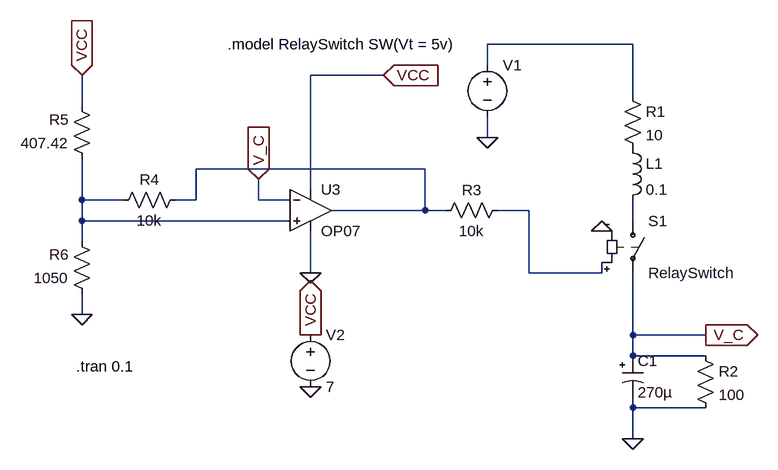
[diagram p0: schematic ON_OFF.asc]
ON_OFF.asc, the LTspice schematic file:
Version 4
SHEET 1 1508 680
WIRE 624 -112 400 -112
WIRE 400 -80 400 -112
WIRE 240 -64 128 -64
WIRE 624 -32 624 -112
WIRE -224 -16 -224 -64
WIRE 400 32 400 0
WIRE 304 80 -48 80
WIRE 128 112 128 -64
WIRE -224 128 -224 64
WIRE -160 128 -224 128
WIRE -48 128 -48 80
WIRE -48 128 -80 128
WIRE 48 128 48 96
WIRE 96 128 48 128
WIRE 304 144 304 80
WIRE 304 144 160 144
WIRE 336 144 304 144
WIRE 464 144 416 144
WIRE -224 160 -224 128
WIRE 96 160 -224 160
WIRE 624 160 624 128
WIRE -224 192 -224 160
WIRE 128 240 128 176
WIRE 464 240 464 144
WIRE 576 240 576 224
WIRE 576 240 464 240
WIRE -224 304 -224 272
WIRE 624 336 624 240
WIRE 736 336 624 336
WIRE 624 368 624 336
WIRE 736 368 624 368
WIRE 624 448 624 432
WIRE 736 448 624 448
WIRE 624 496 624 448
FLAG 48 96 V_C
IOPIN 48 96 In
FLAG -224 -64 VCC
IOPIN -224 -64 In
FLAG -224 304 0
FLAG 128 240 0
FLAG 240 -64 VCC
IOPIN 240 -64 In
FLAG 128 416 0
FLAG 128 336 VCC
IOPIN 128 336 Out
FLAG 624 496 0
FLAG 736 336 V_C
IOPIN 736 336 Out
FLAG 400 32 0
FLAG 576 176 0
SYMBOL res -64 112 R90
WINDOW 0 0 56 VBottom 2
WINDOW 3 32 56 VTop 2
SYMATTR InstName R4
SYMATTR Value 10k
SYMBOL res -208 80 R180
WINDOW 0 36 76 Left 2
WINDOW 3 36 40 Left 2
SYMATTR InstName R5
SYMATTR Value 407.42
SYMBOL res -208 288 R180
WINDOW 0 36 76 Left 2
WINDOW 3 36 40 Left 2
SYMATTR InstName R6
SYMATTR Value 1050
SYMBOL voltage 128 320 R0
WINDOW 123 0 0 Left 0
WINDOW 39 0 0 Left 0
SYMATTR InstName V2
SYMATTR Value 7
SYMBOL polcap 608 368 R0
SYMATTR Value 270µ
SYMATTR InstName C1
SYMATTR Description Capacitor
SYMATTR Type cap
SYMATTR SpiceLine V=16 Irms=550m Rser=0.14 Lser=0 mfg="Nichicon" pn="UPL1C271MPH" type="Al electrolytic"
SYMBOL voltage 400 -96 R0
WINDOW 3 -352 -59 Invisible 2
WINDOW 123 0 0 Left 0
WINDOW 39 0 0 Left 0
SYMATTR Value PULSE(0 7 0 0.01 0 100 0 0)
SYMATTR InstName V1
SYMBOL res 720 352 R0
SYMATTR InstName R2
SYMATTR Value 100
SYMBOL res 608 -48 R0
SYMATTR InstName R1
SYMATTR Value 10
SYMBOL ind 608 32 R0
SYMATTR InstName L1
SYMATTR Value 0.1
SYMBOL res 432 128 R90
WINDOW 0 0 56 VBottom 2
WINDOW 3 32 56 VTop 2
SYMATTR InstName R3
SYMATTR Value 10k
SYMBOL OpAmps\\OP07 128 80 R0
SYMATTR InstName U3
SYMBOL sw 624 144 R0
SYMATTR InstName S1
SYMATTR Value RelaySwitch
TEXT -144 384 Right 2 !.tran 0.1
TEXT 0 -112 Left 2 !.model RelaySwitch SW(Vt = 5v)

The netlist it stands for:
* ON_OFF.asc
R4 N002 N003 10k
R5 N003 VCC 407.42
R6 0 N003 1050
V2 VCC 0 7
C1 V_C 0 270µ V=16 Irms=550m Rser=0.14 Lser=0 mfg="Nichicon" pn="UPL1C271MPH" type="Al electrolytic"
V1 N001 0 PULSE(0 7 0 0.01 0 100 0 0)
R2 V_C 0 100
R1 N001 P001 10
L1 P001 N005 0.1
R3 N004 N002 10k
XU3 N003 V_C VCC 0 N002 LT1001  ; OP07, pins In+ In- V+ V- OUT
S1 N005 V_C N004 0 RelaySwitch
.tran 0.1
.model RelaySwitch SW(Vt = 5v)
.lib LTC.lib
.backanno
.end